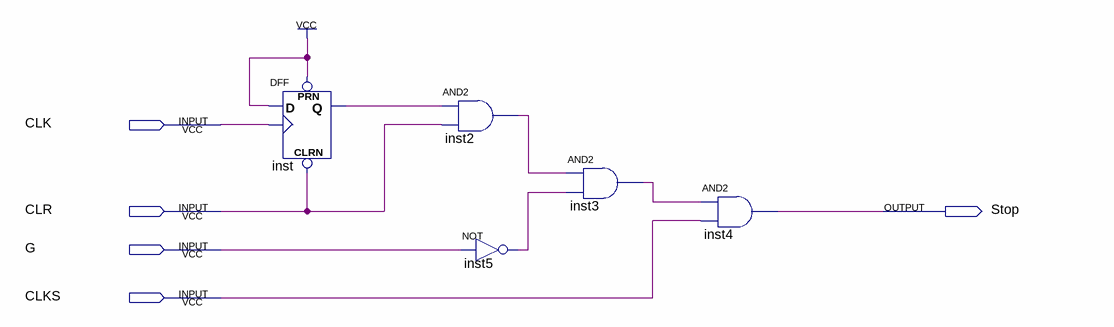
[diagram p0: schematic sheet]
// Quartus schematic Contrl-clk.bdf as structural Verilog: 5 symbols, 5 pins
module \Contrl-clk  (
  input  CLK,
  input  CLR,
  input  G,
  input  CLKS,
  output Stop
);

  wire inst2_out, inst3_out, inst5_out, inst_q;

  DFF inst (.CLRN(CLR), .CLK(CLK), .D(1'b1), .PRN(1'b1), .Q(inst_q));
  and inst2 (inst2_out, inst_q, CLR);
  not inst5 (inst5_out, G);
  and inst3 (inst3_out, inst2_out, inst5_out);
  and inst4 (Stop, inst3_out, CLKS);
endmodule
